# Altium schematic sheet ATMega32u4.SchDoc
size A4; SheetNumber: 18; SheetTotal: 21
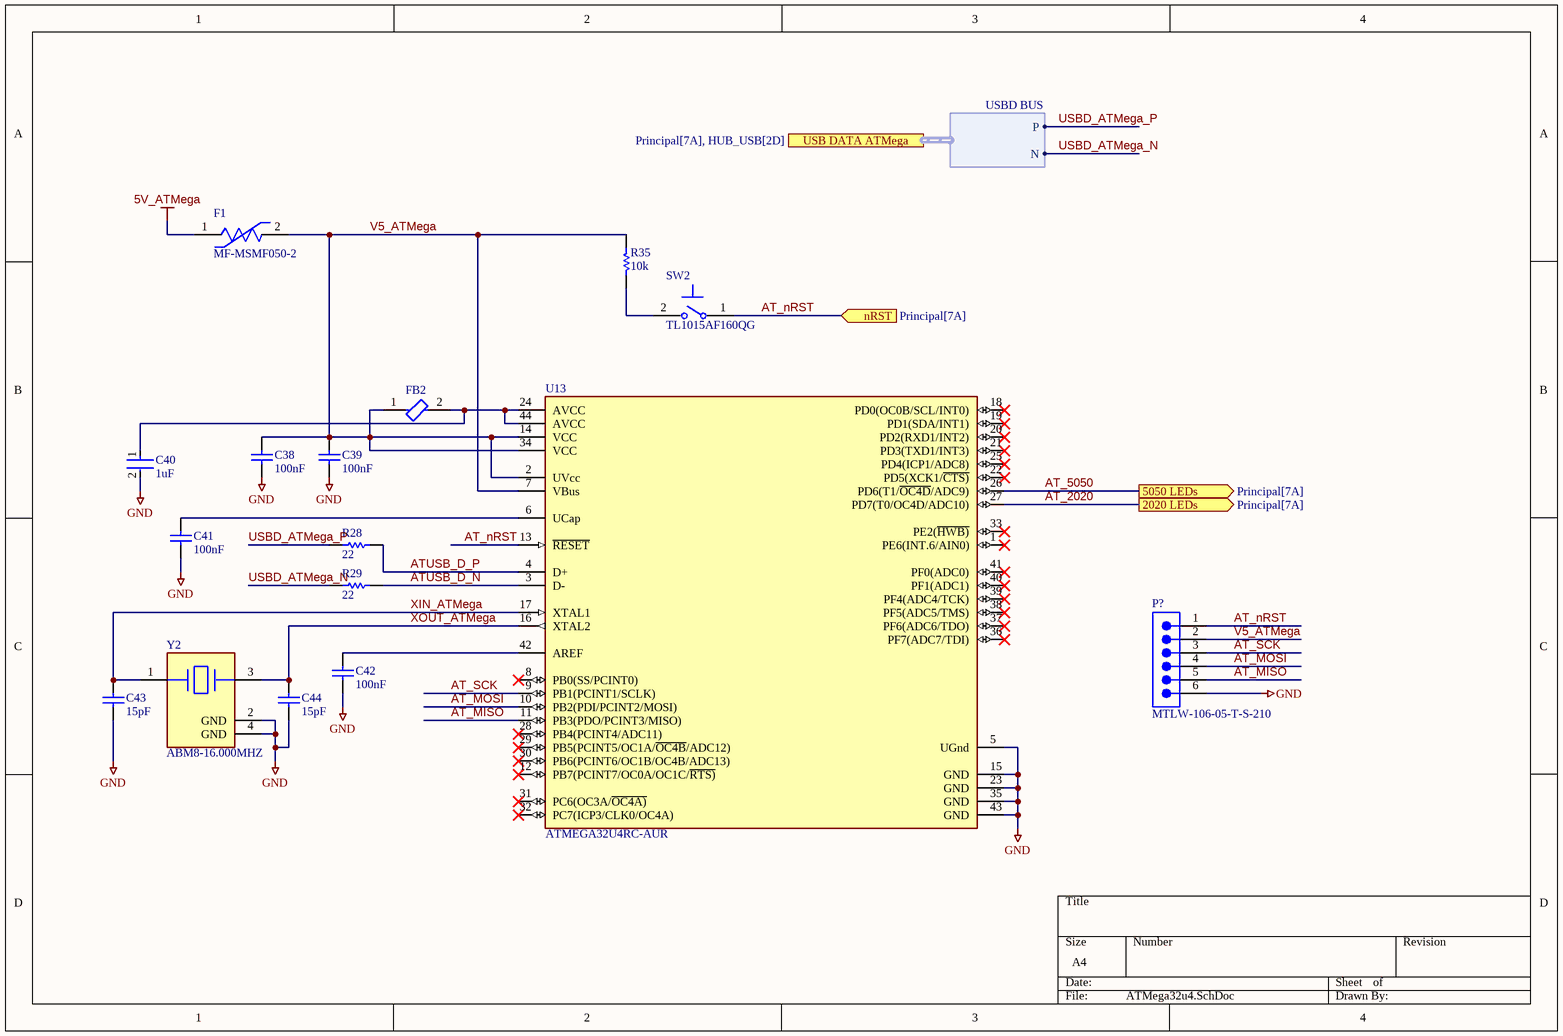
[diagram p0: ATMega32u4.SchDoc]

## Parts
C38  100nF  [CAPC1005X55X25NL05T05]
C39  100nF  [CAPC1005X55X25NL05T05]
C40  1uF  [FP-C0402C-BB-IPC_B]
C41  100nF  [CAPC1005X55X25NL05T05]
C42  100nF  [CAPC1005X55X25NL05T05]
C43  15pF  [CAPC1005X56X25NL10T15]
C44  15pF  [CAPC1005X56X25NL10T15]
F1  MF-MSMF050-2  [FP-MF-MSMF050-2-MFG]
FB2  MH2029-300Y  [FP-MH2029-MFG]  (value not drawn)
P?  MTLW-106-05-T-S-210  [SMTC-MTLW-106-05-X-S-210]
R28  22  [RESC1005X40X25NL05T05]
R29  22  [RESC1005X40X25NL05T05]
R35  10k  [RESC1005X40X25NL05T05]
SW2  TL1015AF160QG  [FP-TL1015AF160QG-MFG]
U13  ATMEGA32U4RC-AUR  [FP-ML-MFG]
Y2  ABM8-16.000MHZ  [FP-ABM8-MFG]

## Ports
2020 LEDs (out, see Principal[7A]), 5050 LEDs (out, see Principal[7A]), nRST (in, see Principal[7A]), USB DATA ATMega (harness USBD BUS, see Principal[7A], HUB_USB[2D])

## Harnesses
USBD BUS: P, N

## Nets
5V_ATMega: F1.1
GND: C38.1 C39.1 C40.2 C41.1 C42.1 C43.1 C44.1 P?.6 U13.5(UGnd) U13.15(GND) U13.23(GND) U13.35(GND) U13.43(GND) Y2.2(GND) Y2.4(GND)
AT_2020: U13.27(PD7(T0/OC4D/ADC10)) ; port 2020 LEDs
AT_5050: U13.26(PD6(T1/~{OC4D}/ADC9)) ; port 5050 LEDs
AT_MISO: P?.5 U13.11(PB3(PDO/PCINT3/MISO))
AT_MOSI: P?.4 U13.10(PB2(PDI/PCINT2/MOSI))
AT_nRST: P?.1 SW2.1 U13.13(~{RESET}) ; port nRST
AT_SCK: P?.3 U13.9(PB1(PCINT1/SCLK))
ATUSB_D_N: R29.2 U13.3(D-)
ATUSB_D_P: R28.2 U13.4(D+)
USBD_ATMega_N: R29.1 ; port USB DATA ATMega.N
USBD_ATMega_P: R28.1 ; port USB DATA ATMega.P
V5_ATMega: C38.2 C39.2 F1.2 FB2.1 P?.2 R35.2 U13.2(UVcc) U13.7(VBus) U13.14(VCC) U13.34(VCC)
XIN_ATMega: C43.2 U13.17(XTAL1) Y2.1
XOUT_ATMega: C44.2 U13.16(XTAL2) Y2.3
NetC40_1: C40.1 FB2.2 U13.24(AVCC) U13.44(AVCC)
NetC41_2: C41.2 U13.6(UCap)
NetC42_2: C42.2 U13.42(AREF)
NetR35_1: R35.1 SW2.2

Not connected (* = marked no-connect by the designer): U13 1(PE6(INT.6/AIN0))* 8(PB0(SS/PCINT0))* 12(PB7(PCINT7/OC0A/OC1C/~{RTS)})* 18(PD0(OC0B/SCL/INT0))* 19(PD1(SDA/INT1))* 20(PD2(RXD1/INT2))* 21(PD3(TXD1/INT3))* 22(PD5(XCK1/~{CTS)})* 25(PD4(ICP1/ADC8))* 28(PB4(PCINT4/ADC11))* 29(PB5(PCINT5/OC1A/~{OC4B}/ADC12))* 30(PB6(PCINT6/OC1B/OC4B/ADC13))* 31(PC6(OC3A/~{OC4A)})* 32(PC7(ICP3/CLK0/OC4A))* 33(PE2(~{HWB)})* 36(PF7(ADC7/TDI))* 37(PF6(ADC6/TDO))* 38(PF5(ADC5/TMS))* 39(PF4(ADC4/TCK))* 40(PF1(ADC1))* 41(PF0(ADC0))*

## Library data of the parts
C38 C39 C41 C42 = CMP-2008-02030-1: Manufacturer: Vitramon; Part Number: VJ0402Y104KXJCW1BC
C40 = CMP-03020-034679-1: CAP CER 1UF 16V X5R 0402; Dielectric Material: Ceramic; Tolerance: 10%; RoHS Compliant: Yes; Voltage Rating (DC): 16V; Voltage Rating: 16V; Max Operating Temperature: 85°C; Packaging: Cut Tape; Width: 0.02inch; Dielectric: X5R; Lead Free: Lead Free; Min Operating Temperature: -55°C; Mount: Surface Mount; Case/Package: 0402; Thickness: 0.022inch; REACH SVHC: No SVHC; Length: 0.039inch; Case Code (Metric): 1005; Case Code (Imperial): 0402; Capacitance: 1uF
C43 C44 = CMP-2008-02762-1: Manufacturer: AVX Interconnect / Elco; Part Number: 0402YA150JAT2A
F1 = CMP-2100-03653-2: PTC RESET FUSE 15V 500MA 1812; Manufacturer: Bourns; Value: 0.15-1Ω; Trip Current: 1A; Automotive Grade: Grade 3; Trip Time: 0.15s; Current Rating: 100A; Hold Current: 0.5A; Height: 0.85mm; Package: 1812; Voltage Rating: 15V; Temperature Range High: +85°C; Device Class L2: PTC Resettable Fuses; Lead Free: Yes; ComponentLink2URL: http://www.bourns.com/docs/Product-Datasheets/mfmsmf.pdf; Ambient Temperature Range High: +85°C; Mouser Description: PTC Resettable Fuse 0.5A(hold) 1A(trip) 15V 100A 0.8W 0.15s 0.15Ohm SMD Solder Pad 1812 T/R; Digikey Description: PTC RESET FUSE 15V 500MA 1812; Manufacturer Part Number: MF-MSMF050-2; Resistance: 0.15-1Ω; Category: Fuse; ComponentLink2Description: Datasheet; Automotive: Yes; Temperature Range Low: -40°C; RoHS: TRUE; Device Class L1: Circuit Protection; Temperature: -40°C to +85°C; Octopart: https://octopart.com/mf-msmf050-2-bourns-28047; Ambient Temperature Range Low: -40°C; Device Class L3: unset
FB2 = CMP-07252-000001-1: FERRITE BEAD 30 OHM 0805 1LN; Manufacturer: Bourns; Series Resistance: 25mΩ; Resistance: 30Ω; Value: 30Ω; Impedance At Frequency: 30Ω @ 100MHz; Rms Current: 3A; Tolerance: 25%; RoHS: TRUE; Manufacturer Part Number: MH2029-300Y; Temperature Range High: +125°C; Device Class L3: Ferrite Beads and Chips; Core Material: Ferrite; ComponentLink2Description: Datasheet; Category: FBead; Octopart: https://octopart.com/mh2029-300y-bourns-756929; Digikey Description: FERRITE BEAD 30 OHM 0805 1LN; Device Class L2: EMI / RFI Components; Lead Free: Yes; Mouser Description: Ferrite Beads 30 ohms 25% HIGH CURRENT; Automotive: No; Ipc Land Pattern Name: CAPC200120X90; Temperature: -55°C to +125°C; Device Class L1: Passive Components; Height: 1.1mm; ComponentLink2URL: https://www.bourns.com/docs/Product-Datasheets/mh.pdf; Package: MH2029; Temperature Range Low: -55°C
P? = CMP-1024-00082-1: Low Profile .025" SQ Post Header, Through-hole, Vertical, -55 to 105 degC, 2.54 mm Pitch, 6-Pin, Male, RoHS; Manufacturer: Samtec; Pitch: 2.54 mm; ComponentLink1Description: Manufacturer URL; ComponentLink2URL: http://www.samtec.com/documents/webfiles/pdf/MTLW_TH.PDF; RoHS: True; DatasheetVersion: F-214; PackageVersion: T, 6/1991; ComponentLink3URL: http://www.samtec.com/documents/webfiles/cpdf/MTLW-1XX-XX-XX-X-XXX-XX-XX-MKT1.pdf; Temperature Range: -55 to 105 degC; Orientation: Vertical; PartNumber: MTLW-106-05-T-S-210; ComponentLink2Description: Datasheet; PackageDescription: Low Profile Terminal Assembly; Mounting Technology: Through-hole; ComponentLink1URL: http://www.samtec.com; ComponentLink3Description: Package Specification; PackageReference: MTLW-106-05-X-S-210
R28 R29 = CMP-2002-01135-4: Chip Resistor, 22 Ohm, +/- 1%, 0.1 W, -55 to 155 degC, 0402 (1005 Metric), RoHS, Tape and Reel; PartNumber: ERJ-2RKF22R0X; Case\/Package: 0402; Resistance: 22 Ohm; Power Rating: 100 mW; Voltage Rating: 50 V; ComponentLink2Description: Datasheet; Packaging: Tape and Reel; Weight: 2.8E-05oz; Pins: 2; Case Code (Imperial): 0402; Width: 0.5 mm; ComponentLink2URL: http://industrial.panasonic.com/cdbs/www-data/pdf/RDA0000/AOA0000C86.pdf; Height: 0.35 mm; PackageReference: 0402; REACH SVHC: Yes; Min Operating Temperature: -55 degC; Length: 1 mm; DatasheetVersion: 04/2015; RoHSCompliant: true; Package Quantity: 10000; Case Code (Metric): 1005; PackageDescription: 2-Pin Surface Mount Device, Body 1 x 0.5 mm; ComponentLink1URL: http://www.panasonic.com/; Mount: Surface Mount; Mounting Technology: Surface Mount; Tolerance: 1%; Max Operating Temperature: 155 degC; ComponentLink1Description: Manufacturer URL
R35 = CMP-2002-00601-1: Manufacturer: Panasonic; Part Number: ERJ-2RHD1002X
SW2 = CMP-17879-000003-1: SWITCH TACTILE SPST-NO 0.05A 12V; Actuator Type: Standard; Actuator Length: 0.5mm; Contact Current Rating: 50mA; Mechanical Life: 200000Cycles; Switch Function: Off-Mom; Switch Travel: 0.2mm; Illumination Type: Non-Illuminated; Operating Force: 160gf; Actuator Material: Nylon; Electrical Life: 50000Cycles; Throw Configuration: SPST; Contact Resistance: 100mR; Orientation: Straight; Max Voltage Rating (DC): 12V; Max Operating Temperature: 70°C; Package Quantity: 1; Contact Material: Silver; Packaging: Tape and Reel; Mount: Surface Mount; Color: Beige; Termination: Gull Wing; Case/Package: SMD/SMT; Voltage Rating (DC): 12V; Contact Plating: Silver; REACH SVHC: No SVHC; Min Operating Temperature: -20°C; Current Rating: 50mA; Lead Free: Lead Free
U13 = CMP-06276-000452-1: IC MCU 8BIT 32KB FLASH 44TQFP; Number of Timers/Counters: 4; Min Supply Voltage: 2.7V; Number of I/Os: 26; Data Bus Width: 8b; Interface: I2C; Max Frequency: 16MHz; RAM Size: 2.5KB; Peripherals: Brown-out Detect/Reset; Oscillator Type: Internal; Core Architecture: AVR; Max Supply Voltage: 5.5V; Series: AVR® ATmega; Min Operating Temperature: -40°C; Number of Pins: 44; Memory Type: FLASH; Frequency: 16MHz; Mount: Surface Mount; Case/Package: TQFP; Packaging: Tape and Reel; Memory Size: 32KB; Package Quantity: 1500; Max Operating Temperature: 85°C
Y2 = CMP-27762-003067-1: Crystal 16MHz ±20ppm 18pF SMD-4 3.2mm x 2.5mm; Frequency Stability: 50ppm; ESR (Equivalent Series Resistance): 70R; Packaging: Tape and Reel; Load Capacitance: 18pF; Min Operating Temperature: -20°C; Case/Package: SMD/SMT; Length: 0.126inch; RoHS Compliant: Yes; Max Operating Temperature: 70°C; Width: 0.098inch; Series: ABM8; Frequency: 16MHz; Height: 0.031inch; Mount: Surface Mount; Frequency Tolerance: 20ppm